# EAGLE design untitled (EAGLE 9.6.2)
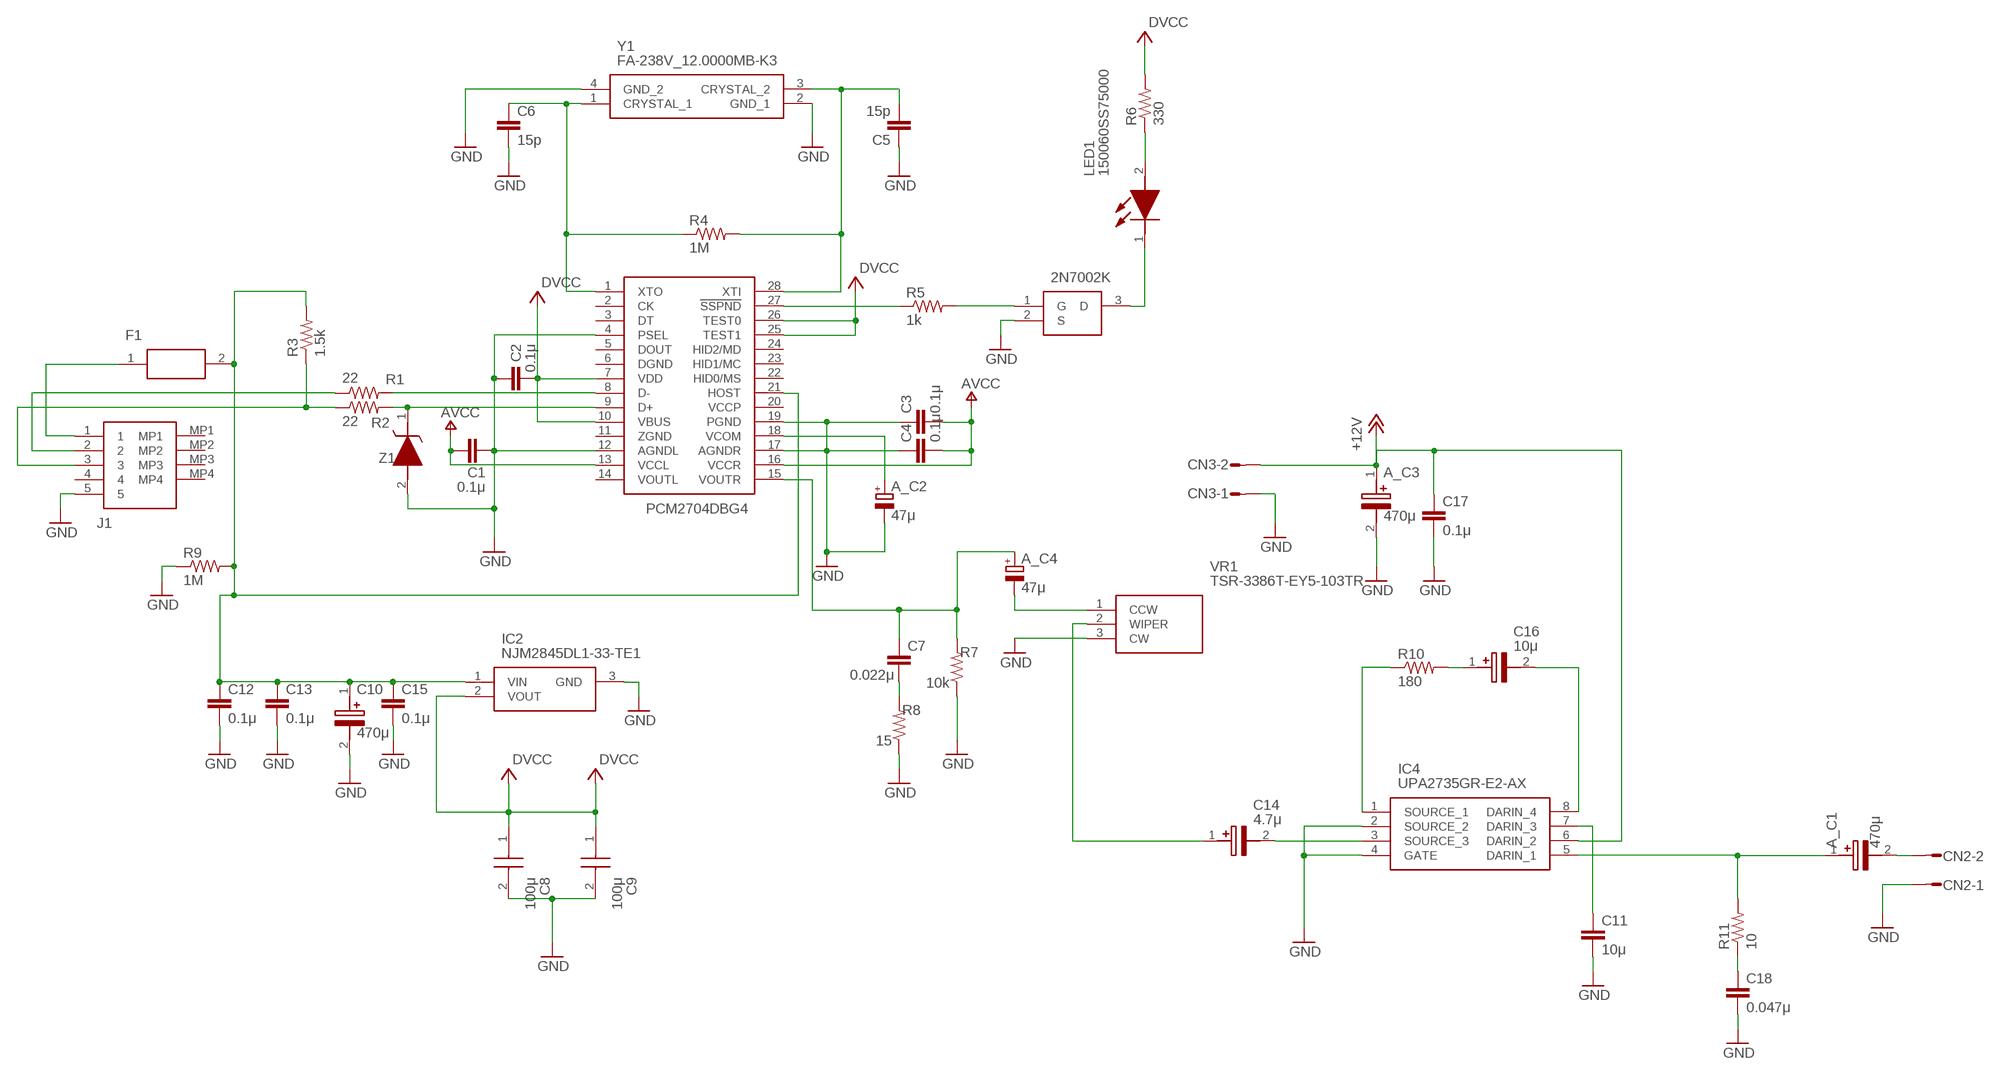
[diagram p0: schematic, sheet 1]

## Parts
A_C1  470μ  25PK470MEFC8X11.5  [CAPPRD350W60D825H1150]
A_C2  47μ  UFG1E470MEM  [UFG1E470MEM]
A_C3  470μ  25PK470MEFC8X11.5  [CAPPRD350W60D825H1150]
A_C4  47μ  UFG1E470MEM  [UFG1E470MEM]
C1  0.1μ  C-EUC0603  [C0603]
C2  0.1μ  C-EUC0603  [C0603]
C3  0.1μ  C-EUC0603  [C0603]
C4  0.1μ  C-EUC0603  [C0603]
C5  15p  C-EUC0603  [C0603]
C6  15p  C-EUC0603  [C0603]
C7  0.022μ  C-EUC0603  [C0603]
C8  100μ  25PK100MEFC5X11  [PK(5X11)]
C9  100μ  25PK100MEFC5X11  [PK(5X11)]
C10  470μ  25PK470MEFC8X11.5  [CAPPRD350W60D825H1150]
C11  10μ  50F2D473J  [50F2D473J]
C12  0.1μ  C-EUC0603  [C0603]
C13  0.1μ  C-EUC0603  [C0603]
C14  4.7μ  50PK4R7MEFC5X11  [CAPPRD200W50D525H1100]
C15  0.1μ  C-EUC0603  [C0603]
C16  10μ  50PK10MEFC5X11  [CAPPRD200W50D550H1250]
C17  0.1μ  C-EUC0603  [C0603]
C18  0.047μ  50F2D473J  [50F2D473J]
CN2  S02P  [S02P]
CN3  S02P  [S02P]
F1  MICROSMD010-2  [MICROSMD175F2]
IC1  PCM2704DBG4  [SOP65P780X200-28N]
IC2  NJM2845DL1-33-TE1  [TO-252-3-L1]
IC3  2N7002K  2N7002KW  [SOT65P210X110-3N]
IC4  UPA2735GR-E2-AX  [SOIC127P600X175-8N]
J1  USB2066-05-RBHM-15-STB-00-00-A  [USB206605RBHM15STB0000A]
LED1  150060SS75000  [LEDC1608X80N]
R1  22  R-US_R0603  [R0603]
R2  22  R-US_R0603  [R0603]
R3  1.5k  R-US_R0603  [R0603]
R4  1M  R-US_R0603  [R0603]
R5  1k  R-US_R0603  [R0603]
R6  330  R-US_R0603  [R0603]
R7  10k  R-US_R0603  [R0603]
R8  15  R-US_R0603  [R0603]
R9  1M  R-US_R0603  [R0603]
R10  180  R-US_R0603  [R0603]
R11  10  R-US_R0603  [R0603]
VR1  TSR-3386T-EY5-103TR  [TSR3386TEY5103TR]
Y1  FA-238V_12.0000MB-K3  [FA238V120000MBK3]
Z1  UDZVTE-175.1B  [UDZVTE1751B]

## Nets
+5V [New Class]: C2.2 C8.1(-) C9.1(-) IC1.7(VDD) IC1.10(VBUS) IC1.25(TEST1) IC1.26(TEST0) IC2.2(VOUT) R6.2 ; supply symbol labelled DVCC
+12V: A_C3.1(+) C17.1 CN3.2 IC4.6(DARIN_2)
GND [New Class]: A_C2.P$2(-) A_C3.2(-) C1.2 C2.1 C3.1 C4.1 C5.1 C6.2 C8.2(+) C9.2(+) C10.2(-) C11.P$2 C12.2 C13.2 C15.2 C17.2 C18.P$2 CN2.1 CN3.1 IC1.4(PSEL) IC1.12(AGNDL) IC1.17(AGNDR) IC1.19(PGND) IC2.3(GND) IC3.2(S) IC4.2(SOURCE_2) IC4.4(GATE) J1.5 R7.1 R8.1 R9.1 VR1.3(CW) Y1.2(GND_1) Y1.4(GND_2) Z1.2(A)
N$1: J1.3 R2.1 R3.1
N$2: IC1.8(D-) R1.2
N$3: IC1.9(D+) R2.2 Z1.1(K)
N$4: J1.2 R1.1
N$5: A_C1.2(-) CN2.2
N$6: C14.1(+) VR1.2(WIPER)
N$7: C16.1(+) R10.2
N$8: C5.2 IC1.28(XTI) R4.2 Y1.3(CRYSTAL_2)
N$9: A_C4.P$2(-) VR1.1(CCW)
N$10: A_C1.1(+) IC4.5(DARIN_1) R11.2
N$11: IC1.27(!SSPND) R5.1
N$12: IC3.1(G) R5.2
N$13: LED1.2(A) R6.1
N$14: IC3.3(D) LED1.1(K)
N$15: C14.2(-) IC4.3(SOURCE_3)
N$16: A_C4.P$1(+) C7.1 IC1.15(VOUTR) R7.2
N$17: C7.2 R8.2
N$18: F1.1 J1.1
N$19: C11.P$1 IC4.7(DARIN_3)
N$20: C10.1(+) C12.1 C13.1 C15.1 F1.2 IC1.21(HOST) IC2.1(VIN) R3.2 R9.2
N$21: C18.P$1 R11.1
N$22: IC4.1(SOURCE_1) R10.1
N$23: C6.1 IC1.1(XTO) R4.1 Y1.1(CRYSTAL_1)
N$24: C16.2(-) IC4.8(DARIN_4)
N$25: A_C2.P$1(+) IC1.18(VCOM)
V+ [New Class]: C1.1 C3.2 C4.2 IC1.13(VCCL) IC1.16(VCCR) ; supply symbol labelled AVCC
Unconnected: IC1.2(CK) IC1.3(DT) IC1.5(DOUT) IC1.6(DGND) IC1.11(ZGND) IC1.14(VOUTL) IC1.20(VCCP) IC1.22(HID0/MS) IC1.23(HID1/MC) IC1.24(HID2/MD) J1.4 J1.MP1 J1.MP2 J1.MP3 J1.MP4

## Library data of the parts
A_C1 A_C3 C10 = SamacSys_Parts:25PK470MEFC8X11.5: Rubycon 470uF 25 V dc Aluminium Electrolytic Capacitor, PK Series 2000h 8 Dia. x 11.5mm Source: Datasheet <http://www.rubycon.co.jp/en/catalog/e_pdfs/aluminum/e_pk.pdf>; DESCRIPTION: Rubycon 470uF 25 V dc Aluminium Electrolytic Capacitor, PK Series 2000h 8 Dia. x 11.5mm; HEIGHT: 11.5mm; MANUFACTURER_NAME: Rubycon; MANUFACTURER_PART_NUMBER: 25PK470MEFC8X11.5; MOUSER_PART_NUMBER: 232-25PK470MEFC8X115; MOUSER_PRICE-STOCK: https://www.mouser.co.uk/ProductDetail/Rubycon/25PK470MEFC8X115?qs=T3oQrply3y%252BFwMonqVFqXg%3D%3D
A_C2 A_C4 = UFG1E470MEM:UFG1E470MEM
C1-C7 C12 C13 C15 C17 = rcl:C-EU: CAPACITOR, European symbol; SPICEPREFIX: C
C8 C9 = SamacSys_Parts:25PK100MEFC5X11: Rubycon 100uF 25 V dc Aluminium Electrolytic Capacitor, PK Series 2000h 5 Dia. x 11mm Source: Datasheet <http://www.rubycon.co.jp/en/catalog/e_pdfs/aluminum/e_pk.pdf>; DESCRIPTION: Rubycon 100uF 25 V dc Aluminium Electrolytic Capacitor, PK Series 2000h 5 Dia. x 11mm; HEIGHT: mm; MANUFACTURER_NAME: Rubycon; MANUFACTURER_PART_NUMBER: 25PK100MEFC5X11; MOUSER_PART_NUMBER: 232-25PK100MEFC5X11; MOUSER_PRICE-STOCK: https://www.mouser.co.uk/ProductDetail/Rubycon/25PK100MEFC5X11?qs=T3oQrply3y8OkZTU9mhEHw%3D%3D
C11 C18 = 50F2D473J:50F2D473J
C14 = SamacSys_Parts:50PK4R7MEFC5X11: Rubycon Aluminium Electrolytic Capacitor PK Series 50V dc 4.7uF, Through Hole Electrolytic, +/-20% +85C Source: Datasheet; DESCRIPTION: Rubycon Aluminium Electrolytic Capacitor PK Series 50V dc 4.7uF, Through Hole Electrolytic, +/-20% +85C; HEIGHT: 11mm; MANUFACTURER_NAME: Rubycon; MANUFACTURER_PART_NUMBER: 50PK4R7MEFC5X11
C16 = SamacSys_Parts:50PK10MEFC5X11: Rubycon 10uF 50 V dc Aluminium Electrolytic Capacitor, PK Series 2000h 5 Dia. x 11mm Source: Datasheet <https://datasheet.datasheetarchive.com/originals/distributors/Datasheets-DGA21/2012915.pdf>; DESCRIPTION: Rubycon 10uF 50 V dc Aluminium Electrolytic Capacitor, PK Series 2000h 5 Dia. x 11mm; HEIGHT: 12.5mm; MANUFACTURER_NAME: Rubycon; MANUFACTURER_PART_NUMBER: 50PK10MEFC5X11; MOUSER_PART_NUMBER: 232-50PK10MEFC5X11; MOUSER_PRICE-STOCK: https://www.mouser.co.uk/ProductDetail/Rubycon/50PK10MEFC5X11?qs=T3oQrply3y%2FPZvLC5mqhwA%3D%3D
CN2 CN3 = con-amp-mt:S02P: AMP MT CONNECTOR; OC_FARNELL: unknown; OC_NEWARK: unknown
F1 = SamacSys_Parts:MICROSMD010-2: PTC RESET FUSE 30V 100MA 1210 Source: Datasheet <http://www.littelfuse.com/~/media/electronics/product_specifications/resettable_ptcs/littelfuse_ptc_microsmd005f_2_product_specification.pdf.pdf>; DESCRIPTION: PTC RESET FUSE 30V 100MA 1210; HEIGHT: 0.85mm; MANUFACTURER_NAME: LITTELFUSE; MANUFACTURER_PART_NUMBER: MICROSMD010-2
IC1 = SamacSys_Parts:PCM2704DBG4: Audio D/A Converter ICs Stereo DAC w/USB Ifc Hdphn & S/PDIF Otpt Source: Datasheet <https://www.ti.com/lit/ds/symlink/pcm2704.pdf?ts=1606889787017&ref_url=https%3A%2F%2Fwww.ti.com%2Fproduct%2FPCM2704%3FkeyMatch%3DPCM2704DBG4%26tisearch%3DSearch-EN-everything%26usecase%3DGPN>; DESCRIPTION: Audio D/A Converter ICs Stereo DAC w/USB Ifc Hdphn & S/PDIF Otpt; HEIGHT: 2mm; MANUFACTURER_NAME: Texas Instruments; MANUFACTURER_PART_NUMBER: PCM2704DBG4; MOUSER_PART_NUMBER: 595-PCM2704DBG4; MOUSER_PRICE-STOCK: https://www.mouser.com/Search/Refine.aspx?Keyword=595-PCM2704DBG4
IC2 = SamacSys_Parts:NJM2845DL1-33-TE1: LDO Voltage Regulators LDO w/On/Off Cntrl Source: Datasheet <https://datasheet.datasheetarchive.com/originals/distributors/Datasheets-DGA25/1780753.pdf>; DESCRIPTION: LDO Voltage Regulators LDO w/On/Off Cntrl; HEIGHT: mm; MANUFACTURER_NAME: New Japan Radio; MANUFACTURER_PART_NUMBER: NJM2845DL1-33-TE1; MOUSER_PART_NUMBER: 513-NJM2845DL133-TE1; MOUSER_PRICE-STOCK: https://www.mouser.co.uk/ProductDetail/NJR/NJM2845DL1-33-TE1?qs=Vf9KeiGtj%252BHsxdmME1E7bA%3D%3D
IC3 = SamacSys_Parts:2N7002KW: 2N7002KW N-Channel MOSFET, 300 mA, 60 V, 3-Pin SOT-23 ON Semiconductor Source: Datasheet <https://www.onsemi.com/pub/Collateral/2N7002KW-D.PDF>; DESCRIPTION: 2N7002KW N-Channel MOSFET, 300 mA, 60 V, 3-Pin SOT-23 ON Semiconductor; HEIGHT: 1.1mm; MANUFACTURER_NAME: ON Semiconductor; MANUFACTURER_PART_NUMBER: 2N7002KW; MOUSER_PART_NUMBER: 512-2N7002KW; MOUSER_PRICE-STOCK: https://www.mouser.co.uk/ProductDetail/ON-Semiconductor-Fairchild/2N7002KW?qs=1%252BQrTMB6OPVOqkaNo2cdQQ%3D%3D
IC4 = SamacSys_Parts:UPA2735GR-E2-AX: General Purpose Power MOSFETs Pch Single Power MOSFET -30V -16A 5.0mohm Power SOP8 Source: Datasheet <https://www.renesas.com/en-us/doc/products/transistor/002/r07ds1319ej0100_pomosfet.pdf>; DESCRIPTION: General Purpose Power MOSFETs Pch Single Power MOSFET -30V -16A 5.0mohm Power SOP8; HEIGHT: 1.75mm; MANUFACTURER_NAME: Renesas Electronics; MANUFACTURER_PART_NUMBER: UPA2735GR-E2-AX
J1 = SamacSys_Parts:USB2066-05-RBHM-15-STB-00-00-A: GCT (GLOBAL CONNECTOR TECHNOLOGY) - USB2066-05-RBHM-15-STB-00-00-A - USB Connector, Mini USB Type B, USB 2.0, Receptacle, 5 Positions, Surface Mount, Right Angle Source: Datasheet; DESCRIPTION: GCT (GLOBAL CONNECTOR TECHNOLOGY) - USB2066-05-RBHM-15-STB-00-00-A - USB Connector, Mini USB Type B, USB 2.0, Receptacle, 5 Positions, Surface Mount, Right Angle; HEIGHT: 4.25mm; MANUFACTURER_NAME: GCT (GLOBAL CONNECTOR TECHNOLOGY); MANUFACTURER_PART_NUMBER: USB2066-05-RBHM-15-STB-00-00-A; MOUSER_PART_NUMBER: 640-2665RBHM15STB00A; MOUSER_PRICE-STOCK: https://www.mouser.co.uk/ProductDetail/GCT/USB2066-05-RBHM-15-STB-00-00-A?qs=KUoIvG%2F9IlZEo87a0wQR%252BA%3D%3D
LED1 = SamacSys_Parts:150060SS75000: LED,Wurth Elektronik,150060SS75000 Wurth Elektronik 150060SS75000, WL-SMCW Series Red LED, 630 nm, 1608 (0603) Clear, Rectangle Lens SMD Package Source: Datasheet; DESCRIPTION: LED,Wurth Elektronik,150060SS75000 Wurth Elektronik 150060SS75000, WL-SMCW Series Red LED, 630 nm, 1608 (0603) Clear, Rectangle Lens SMD Package; HEIGHT: 0.8mm; MANUFACTURER_NAME: Wurth Elektronik; MANUFACTURER_PART_NUMBER: 150060SS75000; MOUSER_PART_NUMBER: 710-150060SS75000; MOUSER_PRICE-STOCK: https://www.mouser.co.uk/ProductDetail/Wurth-Elektronik/150060SS75000?qs=LlUlMxKIyB0oQaxwspeTEA%3D%3D
R1-R11 = rcl:R-US_: RESISTOR, American symbol; SPICEPREFIX: R
VR1 = SamacSys_Parts:TSR-3386T-EY5-103TR: Square Trimming Potentiometer /02 Source: Datasheet <https://akizukidenshi.com/download/ds/suntan/tsr-3386.pdf>; DESCRIPTION: Square Trimming Potentiometer /02; HEIGHT: 4.83mm; MANUFACTURER_NAME: SUNTAN; MANUFACTURER_PART_NUMBER: TSR-3386T-EY5-103TR
Y1 = SamacSys_Parts:FA-238V_12.0000MB-K3: Crystals 12.0000MHz 50ppm 10pF -40C +85C Source: Datasheet <https://support.epson.biz/td/api/doc_check.php?dl=brief_FA-238V&lang=en>; DESCRIPTION: Crystals 12.0000MHz 50ppm 10pF -40C +85C; HEIGHT: 0.7mm; MANUFACTURER_NAME: Epson Timing; MANUFACTURER_PART_NUMBER: FA-238V 12.0000MB-K3; MOUSER_PART_NUMBER: 732-FA238V12.B-K3; MOUSER_PRICE-STOCK: https://www.mouser.co.uk/ProductDetail/Epson-Timing/FA-238V-120000MB-K3?qs=6J2kD0vu%2F2URNf%252BvkglO1g%3D%3D
Z1 = SamacSys_Parts:UDZVTE-175.1B: Zener Diodes Diode Zener Sgl 5.09V 200mW Source: Datasheet <https://datasheet.lcsc.com/szlcsc/ROHM-Semicon-UDZVTE-175-1B_C209561.pdf>; DESCRIPTION: Zener Diodes Diode Zener Sgl 5.09V 200mW; HEIGHT: 0.9mm; MANUFACTURER_NAME: ROHM Semiconductor; MANUFACTURER_PART_NUMBER: UDZVTE-175.1B; MOUSER_PART_NUMBER: 755-UDZVTE-175.1B; MOUSER_PRICE-STOCK: https://www.mouser.co.uk/ProductDetail/ROHM-Semiconductor/UDZVTE-1751B?qs=QcFhgjUTvvrvmr%2FmWJ7Qnw%3D%3D

## Net classes
0 default: clearance 0.152 mm
1 New Class: width 0.254 mm, clearance 0.152 mm to class 0, clearance 0.152 mm

## Board
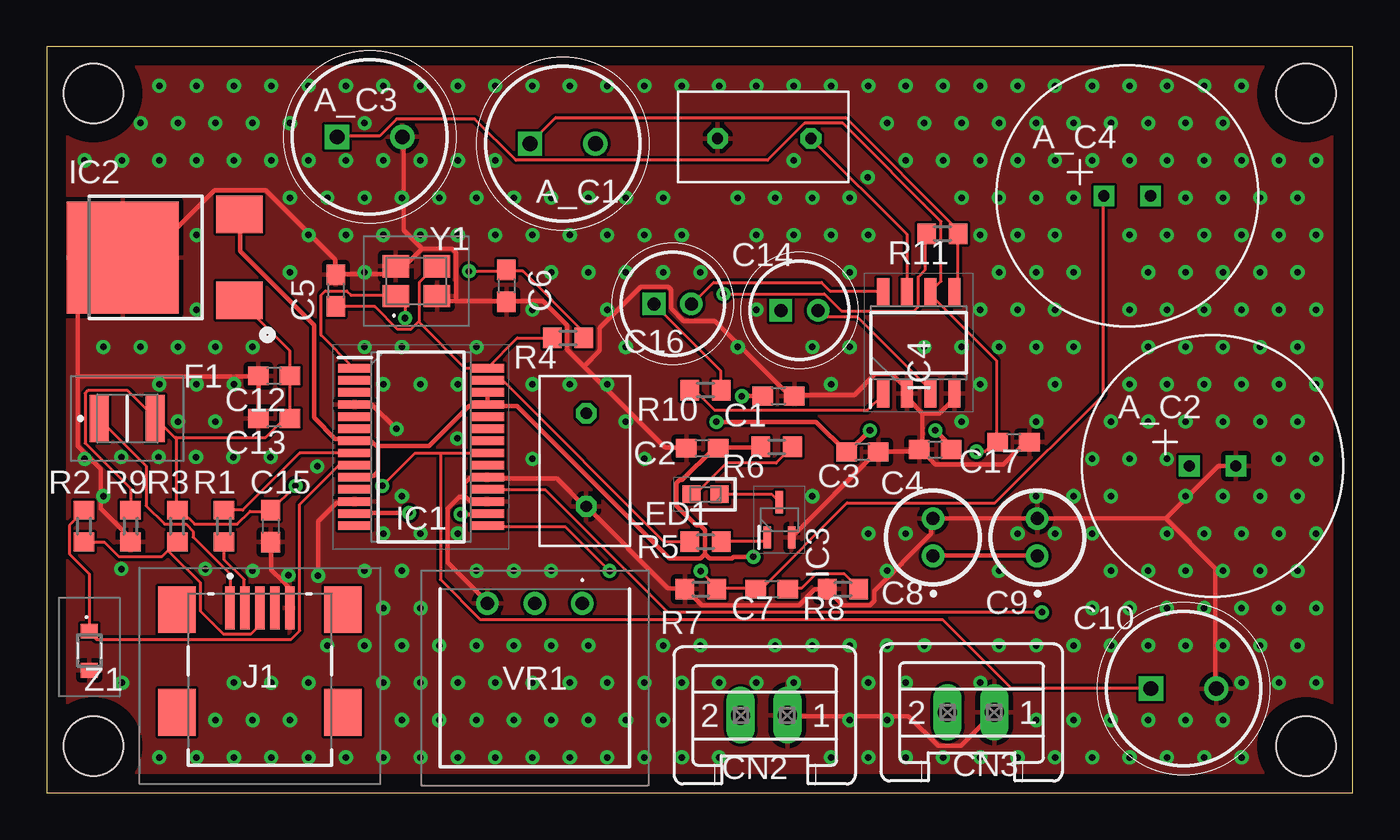
[diagram p1: board, top side]
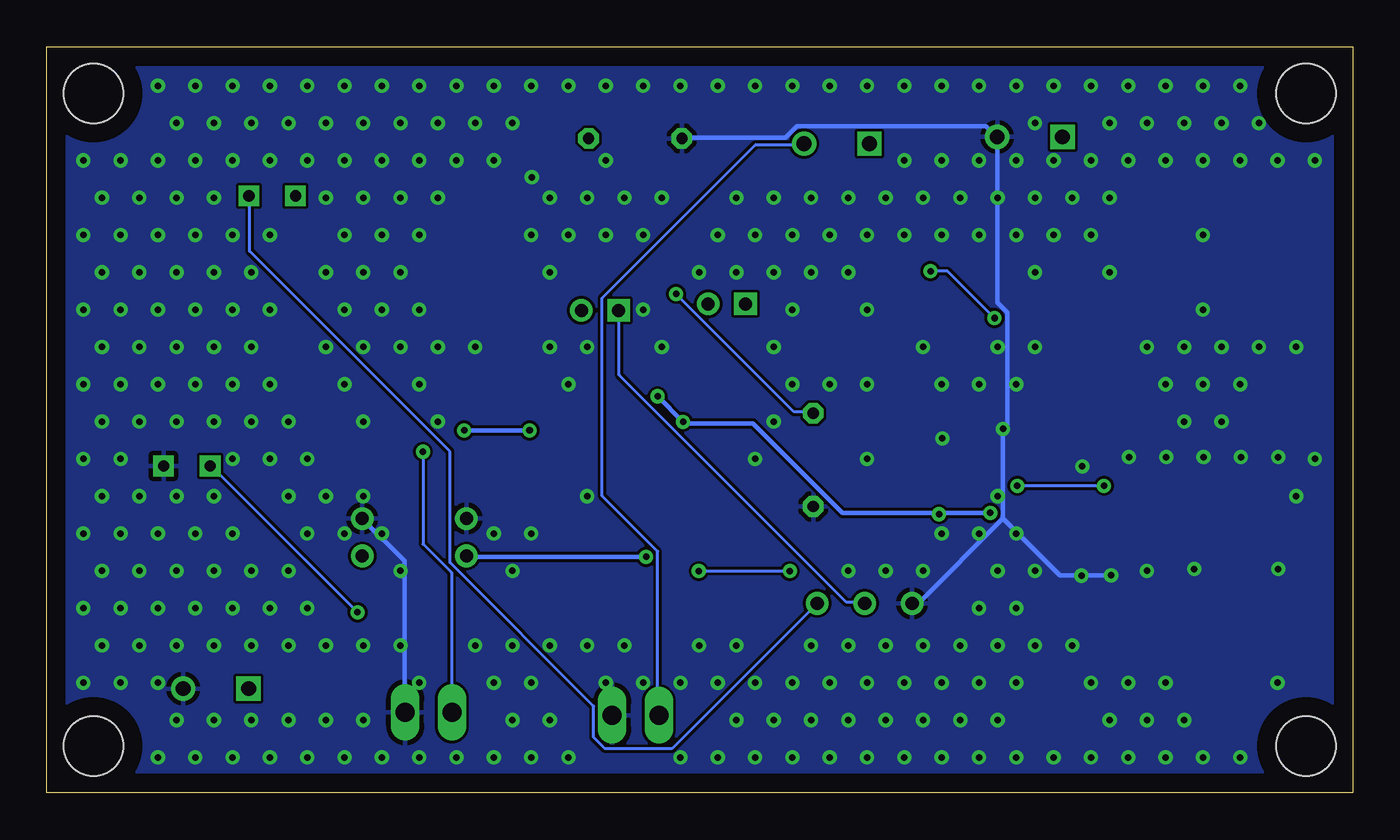
[diagram p2: board, bottom side, seen from below]

Size 70 x 40 mm. Coordinates in mm from the lower left corner, seen from the top.
Outline: 0,0 70,0 70,40 0,40 0,0
Copper layers (1*16): Top 0.035mm / dielectric 1.5mm / Bottom 0.035mm
Design rules "default": minimum track width 6mil, minimum drill 0.35mm, track to track 6mil, track to pad 6mil, pad to pad 6mil, via to via 6mil, smd to smd 6mil, copper to edge 40mil, drill to drill 6mil, minimum pad ring 10mil, minimum via ring 8mil, stop-mask expansion 4mil, vias tented up to drill 0mil, thermal gap 10mil
Holes 3.2 mm at 2.5,37.5 2.5,2.5 67.5,37.5 67.5,2.5

### Footprints (pad centres in the part's own frame; a part is rotated, then mirrored left to right if it is on the bottom)
CAPPRD350W60D825H1150 = drill 0.8 pad 1.2 square: 1 0,0 | drill 0.8 pad 1.2: 2 3.5,0
UFG1E470MEM = drill 0.6 square: P$1 -1.25,0; P$2 1.25,0
C0603 = smd 1.1 x 1: 1 -0.85,0; 2 0.85,0
PK(5X11) = drill 0.7 pad 1.2: 1 0,-1; 2 0,1
50F2D473J = drill 0.6 octagon: P$1 2,2.5; P$2 7,2.5
CAPPRD200W50D525H1100 = drill 0.7 pad 1.1 square: 1 0,0 | drill 0.7 pad 1.1: 2 2,0
CAPPRD200W50D550H1250 = drill 0.7 pad 1.1 square: 1 0,0 | drill 0.7 pad 1.1: 2 2,0
S02P = drill 1.016 long: 1 1.25,0; 2 -1.25,0
MICROSMD175F2 = smd 1 x 2.5: 1 -1.5,0; 2 1.5,0
SOP65P780X200-28N = smd 1.8 x 0.45: 1 -3.55,4.225; 2 -3.55,3.575; 3 -3.55,2.925; 4 -3.55,2.275; 5 -3.55,1.625; 6 -3.55,0.975; 7 -3.55,0.325; 8 -3.55,-0.325; 9 -3.55,-0.975; 10 -3.55,-1.625; 11 -3.55,-2.275; 12 -3.55,-2.925; 13 -3.55,-3.575; 14 -3.55,-4.225; 15 3.55,-4.225; 16 3.55,-3.575; 17 3.55,-2.925; 18 3.55,-2.275; 19 3.55,-1.625; 20 3.55,-0.975; 21 3.55,-0.325; 22 3.55,0.325; 23 3.55,0.975; 24 3.55,1.625; 25 3.55,2.275; 26 3.55,2.925; 27 3.55,3.575; 28 3.55,4.225
TO-252-3-L1 = smd 2 x 2.5: 1 -2.3,-8.05; 2 2.3,-8.05 | smd 6 x 6: 3 0,-1.8
SOT65P210X110-3N = smd 1.2 x 0.4: 1 -0.95,0.65; 2 -0.95,-0.65; 3 0.95,0
SOIC127P600X175-8N = smd 1.5 x 0.65: 1 -2.725,1.905; 2 -2.725,0.635; 3 -2.725,-0.635; 4 -2.725,-1.905; 5 2.725,-1.905; 6 2.725,-0.635; 7 2.725,0.635; 8 2.725,1.905
USB206605RBHM15STB0000A = smd 0.5 x 2.3: 1 -1.6,5.6; 2 -0.8,5.6; 3 0,5.6; 4 0.8,5.6; 5 1.6,5.6 | smd 2 x 2.5: MP1 -4.45,5.5; MP2 4.45,5.5; MP3 4.45,0; MP4 -4.45,0
LEDC1608X80N = smd 0.95 x 0.95: 1 -0.75,0; 2 0.75,0
R0603 = smd 1 x 1.1: 1 -0.85,0; 2 0.85,0
TSR3386TEY5103TR = drill 0.71 pad 1.217: 1 0,0; 2 2.54,0; 3 5.08,0
FA238V120000MBK3 = smd 1.4 x 1.2: 1 -1.1,-0.8; 2 1.1,-0.8; 3 1.1,0.8; 4 -1.1,0.8
UDZVTE1751B = smd 0.9 x 0.8: 1 0,1.05; 2 0,-1.05

### Placement (x,y rotation side)
A_C1  25.91,34.8 0 top
A_C2  62.48,17.53 0 top
A_C3  15.56,35.16 0 top
A_C4  57.91,32 0 top
C1  39.22,21.27 0 top
C2  35.14,18.48 0 top
C3  43.72,18.27 180 top
C4  47.62,18.4 0 top
C5  15.49,26.92 270 top
C6  24.64,27.18 270 top
C7  38.86,10.92 0 top
C8  47.5,13.7 0 top
C9  53.09,13.7 0 top
C10  59.18,5.59 0 top
C11  42.96,37.58 180 top
C12  12.19,22.35 180 top
C13  12.19,20.07 180 top
C14  39.35,25.86 0 top
C15  12,14.3 270 top
C16  32.55,26.21 0 top
C17  51.82,18.8 0 top
C18  26.42,22.35 270 top
CN2  38.44,4.16 0 top
CN3  49.53,4.32 0 top
F1  4.32,20.07 0 top
IC1  20.07,18.54 0 top
IC2  2.29,28.7 90 top
IC3  39.27,14.64 90 top
IC4  46.74,24.13 90 top
J1  11.43,4.32 0 top
LED1  35.31,16 180 top
R1  9.5,14.3 90 top
R2  2,14.3 90 top
R3  7,14.3 90 top
R4  27.94,24.38 180 top
R5  35.31,13.46 0 top
R6  39.12,18.54 180 top
R7  35.05,10.92 0 top
R8  42.67,10.92 0 top
R9  4.5,14.3 90 top
R10  35.31,21.59 0 top
R11  48.01,29.97 0 top
VR1  28.7,10.16 180 top
Y1  19.81,27.43 0 top
Z1  2.29,7.62 0 top

### Tracks (layer width: path | path; a pad name or v marks a point on that pad's centre or on a via)
+5V  (via drill 0.35)
  Top 0.254: C8.1 47.55,12.72 53.03,12.72 C9.1 | 17.75,18.52 17.75,17.22 17.53,16.99 16.54,16.99 IC1.10 | 17.75,18.52 17.45,18.82 16.54,18.82 IC1.7 16.46,18.97 15.47,18.97 14.33,20.12 14.33,25.07 10.36,29.03 10.36,30.94 IC2.2 | R6.2 38.25,18.52 36.04,18.52 C2.2 35.89,18.44 35.74,18.44 34.06,16.76 33.91,16.76 33.76,16.61 33.76,15.39 34.82,14.33 35.05,14.33 35.28,14.1 35.28,12.8 | IC1.25 23.62,20.88 23.62,21.41 IC1.26 | 35.28,12.8 35.05,12.57 33.38,12.57 25.22,20.73 23.7,20.73 IC1.25 | 17.75,18.52 17.83,18.59 20.5,18.59 22.63,20.73 23.55,20.73 IC1.25 | v37.87,12.65 36.8,12.65 36.73,12.57 35.51,12.57 35.28,12.8
  Bottom 0.254: v37.87,12.65 47.47,12.65 C8.1
+12V  (via drill 0.35)
  Top 0.152: A_C3.1 15.62,35.2 17.83,35.2 18.75,36.12 22.94,36.12 25.15,33.91 38.63,33.91 40.62,35.89 42.67,35.89 47.93,30.63 47.93,27.43 47.4,26.9 IC4.6 47.4,26.82 47.4,26.67 50.9,23.16 50.9,18.82 C17.1 50.83,18.82 50.29,18.29 v49.84,18.29
  Bottom 0.152: v49.84,18.29 49.84,13.34 48.31,11.81 48.31,4.34 CN3.2
GND  (via drill 0.35)
  Top 0.254: C13.2 11.35,20.12 11.35,22.33 C12.2 11.28,22.33 1.68,22.33 | 1.68,22.33 1.68,26.29 4.04,28.65 IC2.3 4.19,28.73 5.41,28.73 8.99,32.31 11.73,32.31 15.47,28.57 15.47,27.89 C5.1 15.54,27.81 18.29,27.81 18.67,28.19 Y1.4 18.82,28.27 19.2,28.27 20.12,29.18 | 1.68,22.33 1.68,18.59 2.9,17.37 2.9,15.24 4.5,13.64 4.5,13.49 R9.1 | 46.94,20.34 47.85,20.34 48.62,21.11 48.62,21.34 IC4.4 | 46.94,20.34 46.18,21.11 46.18,21.34 IC4.2 46.1,21.64 45.26,22.48 44.42,22.48 43.28,21.34 40.08,21.34 C1.2 40.01,21.41 39.7,21.41 35.81,25.3 34.14,25.3 33.45,25.98 33.45,26.98 33.3,27.13 31.85,27.13 29.64,24.92 29.64,23.7 28.8,22.86 | C4.1 46.71,18.36 46.63,18.29 44.58,18.29 C3.1 44.5,18.29 39.93,13.72 IC3.2 | C17.2 52.65,18.75 52.43,18.75 51.28,17.6 47.62,17.6 46.86,18.36 C4.1 | 46.94,20.34 46.94,18.44 C4.1 | 21.95,26.36 21.18,26.36 20.95,26.59 Y1.2 | 21.95,26.36 24.61,26.36 C6.2 24.77,26.36 26.59,26.36 27.89,25.07 27.89,23.77 28.8,22.86 | 28.8,22.86 33.15,18.52 34.21,18.52 C2.1 | 20.12,29.18 21.72,29.18 21.95,28.96 21.95,26.36 | 20.12,29.18 19.13,30.18 19.13,35.13 A_C3.2 | CN2.1 39.7,4.12 46.18,4.12 47.78,2.52 49,2.52 50.75,4.27 CN3.1 | A_C2.P$2 62.79,17.53 59.97,14.71 | 59.97,14.71 53.11,14.71 C9.2 52.96,14.71 47.55,14.71 C8.2 47.4,14.63 47.4,13.87 44.35,10.82 44.35,10.29 44.12,10.06 42.67,10.06 41.91,10.82 R8.1 41.76,10.9 41.15,10.9 40.31,10.06 35.13,10.06 34.29,10.9 R7.1 34.14,10.97 33.3,10.97 28.96,15.32 C18.P$2 28.8,15.39 27.36,16.84 23.7,16.84 IC1.19 23.55,16.92 22.71,16.92 22.4,16.61 22.4,15.93 | 59.97,14.71 62.64,12.04 62.64,5.64 C10.2 | 22.4,15.93 22.71,15.62 23.55,15.62 IC1.17
  Top 0.254: 2.29,6.63 Z1.2 | IC1.12 16.46,15.54 15.54,15.54 14.55,14.55 14.55,11.67 | 12.65,11.35 12.95,11.05 12.95,9.98 J1.5 | 12.65,11.35 12.04,11.96 12.04,13.41 C15.2 | v18.75,19.51 17.45,20.8 16.54,20.8 IC1.4 | v12.95,11.66 12.65,11.35 | 22.4,15.93 22.33,15.85 22.1,15.85 21.49,15.24 21.49,12.34 23.62,10.21 VR1.3
  Bottom 0.254: C11.P$2 35.89,35.13 30.4,35.13 29.79,35.74 19.66,35.74 19.13,35.2 A_C3.2 19.05,35.05 19.05,26.29 18.52,25.76 18.52,19.74 v18.75,19.51 18.75,14.71 | CN3.1 50.83,4.34 50.83,12.42 53.03,14.63 C9.2 | 18.75,14.71 23.24,10.21 23.62,10.21 VR1.3 | v12.95,11.66 14.55,11.66 15.7,11.66 18.75,14.71
  other vias: 2.04,17.9 2.04,33.9 4.04,5.9 3.04,15.9 3.04,23.9 4.04,33.9 6.04,1.9 6.04,21.9 5.04,23.9 6.04,33.9 5.04,35.9 6.04,37.9 8.04,1.9 7.04,19.9 8.04,21.9 7.04,23.9 8.04,25.9 8.04,29.9 8.04,33.9 7.04,35.9 8.04,37.9 10.04,1.9 9.04,3.9 10.04,5.9 9.04,19.9 10.04,21.9 9.04,23.9 10.04,33.9 9.04,35.9 10.04,37.9 12.04,1.9 11.04,3.9 12.04,5.9 11.04,11.9 11.04,23.9 12.04,33.9 11.04,35.9 12.04,37.9 14.04,1.9 13.04,3.9 14.04,5.9 13.04,27.9 14.04,29.9 13.04,31.9 14.04,33.9 13.04,35.9 14.04,37.9 16.04,1.9 15.04,7.9 16.04,29.9 15.04,31.9 16.04,33.9 16.04,37.9 18.04,1.9 18.04,5.9 17.04,7.9 18.04,9.9 17.04,11.9 18.04,13.9 18.04,21.9 17.04,23.9 17.04,27.9 18.04,29.9 17.04,31.9 18.04,33.9 17.04,35.9 18.04,37.9 20.04,1.9 19.04,3.9 20.04,5.9 19.04,7.9 20.04,9.9 19.04,11.9 20.04,13.9 19.04,15.9 20.04,21.9 19.04,23.9 20.04,29.9 19.04,31.9 20.04,33.9 20.04,37.9 22.04,1.9 21.04,3.9 22.04,5.9 21.04,7.9 22.04,13.9 22.04,21.9 22.04,29.9 21.04,31.9 22.04,33.9 22.04,37.9 24.04,1.9 23.04,3.9 24.04,5.9 23.04,7.9 23.04,11.9 23.04,23.9 24.04,29.9 23.04,31.9 24.04,33.9 24.04,37.9 26.04,1.9 25.04,3.9 26.04,5.9 25.04,7.9 25.04,11.9 26.04,17.9 26.04,21.9 26.04,25.9 26.04,29.9 25.04,31.9 26.04,37.9 28.04,1.9 27.04,3.9 28.04,5.9 27.04,7.9 27.04,11.9 28.04,21.9 27.04,27.9 28.04,29.9 27.04,31.9 28.04,37.9 30.04,1.9 29.04,3.9 30.04,5.9 29.04,7.9 30.04,21.9 30.04,25.9 29.04,27.9 30.04,29.9 29.04,31.9 30.04,37.9 32.04,1.9 31.04,3.9 32.04,5.9 32.04,17.9 31.04,19.9 31.04,23.9 31.04,27.9 32.04,29.9 31.04,31.9 32.04,37.9 34.04,1.9 33.04,3.9 34.04,5.9 33.04,7.9 33.04,27.9 34.04,29.9 33.04,31.9 34.04,37.9 36.04,1.9 36.04,5.9 35.04,7.9 35.04,27.9 36.04,37.9 38.04,5.9 37.04,23.9 38.04,25.9 38.04,29.9 37.04,31.9 38.04,37.9 40.04,5.9 39.04,7.9 40.04,29.9 39.04,31.9 40.04,33.9 40.04,37.9 42.04,1.9 41.04,7.9 41.04,15.9 42.04,21.9 41.04,23.9 42.04,29.9 41.04,31.9 42.04,37.9 44.04,1.9 43.04,3.9 44.04,5.9 43.04,7.9 44.04,13.9 43.04,23.9 43.04,27.9 44.04,29.9 43.04,31.9 44.04,37.9 46.04,1.9 45.04,3.9 46.04,5.9 45.04,7.9 45.04,11.9 46.04,13.9 46.04,33.9 45.04,35.9 46.04,37.9 48.04,1.9 47.04,7.9 47.04,23.9 48.04,33.9 47.04,35.9 48.04,37.9 50.04,1.9 50.04,5.9 49.04,19.9 50.04,21.9 49.04,23.9 50.04,25.9 50.04,29.9 49.04,31.9 50.04,33.9 49.04,35.9 50.04,37.9 52.04,1.9 51.04,7.9 51.04,11.9 52.04,13.9 51.04,23.9 52.04,25.9 51.04,27.9 52.04,29.9 51.04,31.9 52.04,33.9 51.04,35.9 52.04,37.9 54.04,1.9 53.04,3.9 53.04,7.9 54.04,13.9 53.04,15.9 53.04,19.9 54.04,21.9 53.04,23.9 54.04,25.9 53.04,27.9 54.04,29.9 53.04,31.9 54.04,33.9 53.04,35.9 54.04,37.9 56.04,1.9 55.04,3.9 55.04,7.9 56.04,9.9 56.04,13.9 55.04,15.9 56.04,17.9 55.04,23.9 55.04,27.9 55.04,31.9 56.04,33.9 55.04,35.9 56.04,37.9 58.04,1.9 57.04,3.9 57.04,7.9 58.04,9.9 57.04,11.9 57.04,15.9 58.04,17.9 57.04,19.9 58.04,21.9 58.04,25.9 58.04,29.9 58.04,33.9 57.04,35.9 58.04,37.9 60.04,1.9 59.04,3.9 59.04,7.9 60.04,9.9 59.04,11.9 60.04,13.9 60.04,17.9 59.04,19.9 60.04,21.9 59.04,23.9 60.04,25.9 59.04,27.9 60.04,29.9 60.04,33.9 59.04,35.9 60.04,37.9 62.04,1.9 61.04,3.9 61.04,7.9 62.04,9.9 61.04,11.9 62.04,13.9 61.04,15.9 61.04,19.9 62.04,21.9 61.04,23.9 62.04,25.9 61.04,27.9 62.04,29.9 61.04,31.9 62.04,33.9 61.04,35.9 62.04,37.9 64.04,1.9 63.04,3.9 64.04,5.9 63.04,7.9 64.04,9.9 63.04,11.9 64.04,13.9 63.04,15.9 63.04,19.9 64.04,21.9 63.04,23.9 64.04,25.9 63.04,27.9 64.04,29.9 63.04,31.9 64.04,33.9 63.04,35.9 64.04,37.9 66.04,5.9 65.04,7.9 66.04,9.9 65.04,11.9 66.04,13.9 65.04,15.9 66.04,17.9 65.04,19.9 66.04,21.9 65.04,23.9 66.04,25.9 65.04,27.9 66.04,29.9 65.04,31.9 66.04,33.9 68.04,5.9 67.04,7.9 68.04,9.9 67.04,11.9 68.04,13.9 67.04,15.9 68.04,17.9 67.04,19.9 68.04,21.9 67.04,23.9 68.04,25.9 67.04,27.9 68.04,29.9 67.04,31.9 68.04,33.9 8,18 10,18 12,18 4,12 8.5,12 44,33 6,18 4,18 14.5,17.5 22,19 14.54,11.64
  pour Top: 0,40 0,0 70,0 70,40
  pour Bottom: 0,40 0,0 70,0 70,40
N$1
  Top 0.152: R2.1 2.06,13.41 3.12,13.41 3.89,12.65 6.17,12.65 6.93,13.41 R3.1 6.55,12.95 8.23,11.28 8.23,9.75 9.45,8.53 10.97,8.53 11.43,8.99 J1.3
N$2
  Top 0.152: R1.2 9.53,15.16 10.52,15.16 13.56,18.21 16.46,18.21 IC1.8
N$3
  Top 0.152: R2.2 1.98,15.09 1.22,14.33 1.22,12.8 2.29,11.73 Z1.1 2.29,8.61 2.67,8.23 13.11,8.23 13.56,8.69 13.56,15.47 15.62,17.53 16.46,17.53 IC1.9
N$4
  Top 0.152: R1.1 9.53,13.41 9.53,12.5 10.59,11.43 10.59,9.98 J1.2
N$5
  Bottom 0.152: A_C1.2 29.41,34.75 32,34.75 40.23,26.52 40.23,15.93 37.26,12.95 37.26,4.19 CN2.2
N$6
  Bottom 0.152: C14.1 39.32,25.83 39.32,22.4 27.13,10.21 26.21,10.21 VR1.2
N$7
  Top 0.152: R10.2 36.12,21.64 36.12,22.63 32.61,26.14 C16.1
N$8
  Top 0.152: R4.2 25.22,24.38 23.62,22.78 IC1.28 23.55,22.78 22.4,22.78 19.93,25.26 | 19.93,25.26 19.96,25.3 19.96,27.36 20.88,28.27 Y1.3 | 19.93,25.26 19.51,24.84 18.82,24.84 17.6,26.06 15.54,26.06 C5.2
N$9
  Bottom 0.152: VR1.1 36.5,2.36 40.08,2.36 40.69,2.97 40.69,4.65 48.39,12.34 48.39,18.29 59.13,29.03 59.13,32 A_C4.P$2
N$10
  Top 0.152: IC4.5 48.69,26.9 48.84,27.05 48.84,29.95 R11.2 48.84,30.02 48.84,30.18 42.82,36.2 27.28,36.2 25.91,34.82 A_C1.1
N$11
  Top 0.152: R5.1 34.44,13.49 33.07,13.49 24.46,22.1 23.62,22.1 IC1.27
N$12
  Top 0.152: R5.2 36.2,13.49 38.41,13.49 38.56,13.64 IC3.1
N$13
  Top 0.152: LED1.2 34.75,16 36.42,17.68 39.09,17.68 39.93,18.52 R6.1
N$14
  Top 0.152: LED1.1 38.86,16 39.24,15.62 IC3.3
N$15
  Top 0.152: IC4.3 47.32,21.41 47.32,21.64 43.43,25.53 41.68,25.53 41.38,25.83 C14.2
N$16  (via drill 0.35)
  Top 0.152: 35.97,10.97 37.95,10.97 C7.1 38.02,10.97 38.33,10.97 42.9,15.54 50.83,15.54 56.62,21.34 56.62,32 A_C4.P$1 | v30.18,11.89 27.81,14.25 23.62,14.25 IC1.15 | 35.97,10.97 v35.05,11.89 | 35.97,10.97 R7.2
  Bottom 0.152: v35.05,11.89 v30.18,11.89
N$17
  Top 0.152: C7.2 39.78,10.97 40.46,10.97 41.22,11.73 42.75,11.73 43.51,10.97 R8.2
N$18
  Top 0.152: J1.1 9.83,9.98 9.83,11.73 7.85,13.72 7.85,14.02 7.47,14.4 6.33,14.4 5.33,15.39 5.33,17.53 2.82,20.04 F1.1
N$19
  Top 0.152: IC4.7 46.1,29.95 41,35.05 C11.P$1
N$20  (via drill 0.35)
  Top 0.152: IC2.1 10.36,26.36 13.03,23.7 13.03,22.4 C12.1 13.03,22.33 13.03,20.12 C13.1 12.95,20.12 12.8,20.12 11.73,19.05 6.93,19.05 6.9,19.01 | R9.2 4.5,15.16 4.5,16.31 2.06,18.75 2.06,21.41 2.21,21.57 4.34,21.57 5.79,20.12 F1.2 5.87,20.04 6.9,19.01 | 6.9,19.01 6.93,18.97 6.93,15.16 R3.2 7.01,15.09 7.24,15.09 7.92,14.4 10.21,14.4 10.9,15.09 11.96,15.09 C15.1 12.04,15.16 v13.34,16.46 | 21.11,18.21 19.74,18.21 v17.98,16.46 | 21.11,18.21 23.55,18.21 IC1.21 | 21.11,18.21 21.11,11.43 23.24,9.3 48.01,9.3 51.66,5.64 59.13,5.64 C10.1
  Bottom 0.152: v13.34,16.46 v17.98,16.46
N$21  (via drill 0.35)
  Top 0.152: v36.27,26.75 41.68,26.75 42.6,25.83 46.48,25.83 46.71,26.06 46.71,27.66 47.09,28.04 47.09,29.95 R11.1
  Bottom 0.152: v36.27,26.75 29.95,20.42 28.96,20.42 C18.P$1
N$22
  Top 0.152: R10.1 34.52,21.57 34.75,21.57 35.81,20.5 43.97,20.5 44.81,21.34 IC4.1
N$23  (via drill 0.35)
  Top 0.152: R4.1 28.73,24.38 28.73,24.77 25.53,27.96 24.69,27.96 C6.1 24.61,27.96 v22.63,27.96 | IC1.1 16.46,22.78 14.71,24.54 14.71,26.67 14.94,26.9 16.08,26.9 16.31,26.67 18.67,26.67 Y1.1 18.75,26.59 19.2,26.14 v19.2,25.45
  Bottom 0.152: v22.63,27.96 21.72,27.96 v19.2,25.45
N$24
  Top 0.152: IC4.8 44.81,26.9 41.99,26.9 41.53,27.36 35.74,27.36 34.59,26.21 C16.2
N$25  (via drill 0.35)
  Top 0.152: v53.34,9.68 33.3,9.68 26.75,16.23 23.62,16.23 IC1.18
  Bottom 0.152: v53.34,9.68 61.19,17.53 A_C2.P$1
V+  (via drill 0.35)
  Top 0.254: v37.26,21.26 38.33,21.26 C1.1 | v35.89,19.89 41.22,19.89 42.82,18.29 C3.2 42.98,18.29 v44.12,19.43 | v47.62,19.43 48.46,18.59 48.46,18.44 C4.2 | v19.43,15.01 16.54,15.01 IC1.13 | v22.17,14.94 23.55,14.94 IC1.16
  Bottom 0.254: v37.26,21.26 v35.89,19.89 35.81,19.81 32.16,19.81 27.36,15.01 22.17,15.01 | v44.12,19.43 v47.62,19.43 | 22.17,15.01 v19.43,15.01 | v22.17,14.94 22.17,15.01